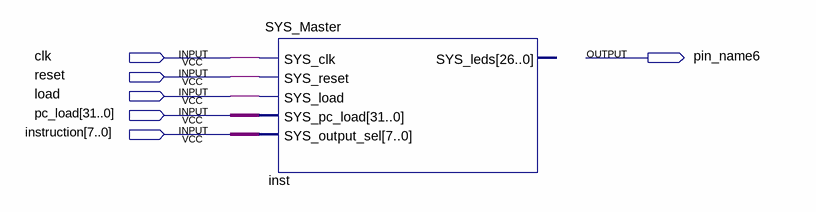
[diagram p0: schematic sheet]
// Quartus schematic SingleClock.bdf as structural Verilog: 1 symbols, 6 pins
module SingleClock (
  input  clk,
  input  reset,
  input  load,
  input  [31:0] pc_load,
  input  [7:0] instruction,
  output pin_name6
);

  SYS_Master inst (
    .SYS_clk(clk), .SYS_reset(reset), .SYS_load(load), .SYS_pc_load(pc_load), .SYS_output_sel(instruction));  // open: SYS_leds
endmodule
